# Altium schematic sheet ESC_Header.SchDoc
size A
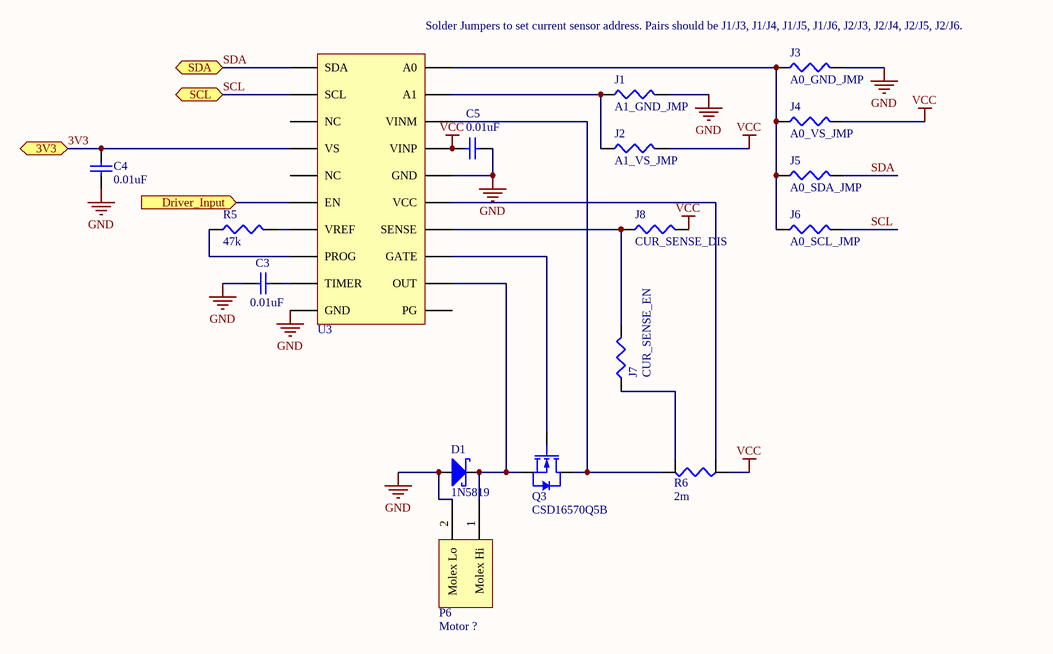
[diagram p0: ESC_Header.SchDoc]

## Parts
C3  value 0.01uF  [C1206]  (hidden comment: Cap Semi)
C4  value 0.01uF  [C1206]  (hidden comment: Cap Semi)
C5  value 0.01uF  [C1206]  (hidden comment: Cap Semi)
D1  1N5819  [1N58xx]
J1  A1_GND_JMP  [J1-0603]
J2  A1_VS_JMP  [J1-0603]
J3  A0_GND_JMP  [J1-0603]
J4  A0_VS_JMP  [J1-0603]
J5  A0_SDA_JMP  [J1-0603]
J6  A0_SCL_JMP  [J1-0603]
J7  CUR_SENSE_EN  [J1-0603]
J8  CUR_SENSE_DIS  [J1-0603]
P6  Motor ?  [76829-0102]
Q3  CSD16570Q5B  [CSD16570Q5B]
R5  47k  [J1-0603]
R6  2m  [WSL27262L000FEB]
U3  TPS2481  [TPS2481]  (value not drawn)

## Ports
3V3 (bidir), Driver_Input (in), SCL (bidir), SDA (bidir)

## Nets
GND: C3.1 C4.1 C5.1 D1.A(Anode) J1.2 J3.2 P6.2(Molex_Lo) U3.10(GND) U3.16(GND)
VCC: C5.2 J2.2 J4.2 J8.2 R6.1 U3.17(VINP)
3V3: C4.2 U3.4(VS) ; port 3V3
Driver_Input: U3.6(EN) ; port Driver_Input
SCL: J6.2 U3.2(SCL) ; port SCL
SDA: J5.2 U3.1(SDA) ; port SDA
NetC3_2: C3.2 U3.9(TIMER)
NetD1_K: D1.K(Cathode) P6.1(Molex_Hi) Q3.S(Source) U3.12(OUT)
NetJ1_1: J1.1 J2.1 U3.19(A1)
NetJ3_1: J3.1 J4.1 J5.1 J6.1 U3.20(A0)
NetJ7_1: J7.1 R6.4
NetJ7_2: J7.2 J8.1 U3.14(SENSE)
NetQ3_D: Q3.D(Drain) R6.2 U3.18(VINM)
NetQ3_G: Q3.G(Gate) U3.13(GATE)
NetR5_1: R5.1 U3.8(PROG)
NetR5_2: R5.2 U3.7(VREF)
NetR6_3: R6.3 U3.15(VCC)

Not connected (* = marked no-connect by the designer): U3 3(NC) 5(NC) 11(PG)

## Notes on the sheet
- Solder Jumpers to set current sensor address. Pairs should be J1/J3, J1/J4, J1/J5, J1/J6, J2/J3, J2/J4, J2/J5, J2/J6.

## Library data of the parts
C3-C5 = Cap Semi: Capacitor (Semiconductor SIM Model); Published: 8-Jun-2000; LatestRevisionDate: 29-May-2009; LatestRevisionNote: IPC-7351 Footprint Added.; PackageReference: C1206; Publisher: Altium Limited; PackageDescription: Chip Capacitor
D1 = 1N58xx: 1A Schottky Barrier Rectifier Diode; Datasheet: http://www.kesenes.com/pdf/1n5817-1n5819.pdf
J1-J8 R5 = Res3: Resistor; Published: 8-Jun-2000; LatestRevisionDate: 29-May-2009; LatestRevisionNote: IPC-7351 Footprint Added.; PackageReference: J1-0603; Publisher: Altium Limited; PackageDescription: Chip Resistor
P6 = Megafit Slim Vert 2 Peg: mfgr_part_num: 76829-0102
Q3 = CSD16570Q5B: MOSFET N-CH 25V 100A 8VSON; Manufacturer: Texas Instruments; Packing: Reel; QG: 250 nC; RDS (on) (max): 0.59 mOhm; VGS(th) (max): 1.9 V; VGS (max): 20 V; Supplier 1: Digikey; Supplier Part Number 1: 296-47753-1-ND; ID (max): 100 A; VDS (max): 25 V; Mounting Technology: Surface Mount; PartNumber: CSD16570Q5B; ComponentLink1Description: Manufacturer URL; ComponentLink1URL: http://www.ti.com/; ComponentLink2Description: Datasheet; ComponentLink2URL: http://www.ti.com/lit/ds/symlink/csd16570q5b.pdf; Digikey Link: https://www.digikey.com/product-detail/en/texas-instruments/CSD16570Q5B/296-47753-1-ND/8133102
R6 = WSL27262L000FEB: 2 mOhms ±1% 3W Chip Resistor Nonstandard Anti-Sulfur, Automotive AEC-Q200, Current Sense, Moisture Resistant, Pulse Withstanding Metal Element; Digikey Link: https://www.digikey.com/product-detail/en/vishay-dale/WSL27262L000FEB/WSLQ-.002CT-ND/2695218; Datasheet Link: http://www.vishay.com/docs/30131/wsl2726.pdf
U3 = TPS2481: Positive voltage, intelligent protection device/hotswap controller and I2C current monitor; Digikey_Link: https://www.digikey.com/product-detail/en/texas-instruments/TPS2481PWR/296-27643-1-ND/2345432; Datasheet_Link: http://www.ti.com/lit/ds/symlink/tps2481.pdf